# Altium schematic sheet Antenna and LoRa.SchDoc
size A3; SheetNumber: 4; SheetTotal: 5
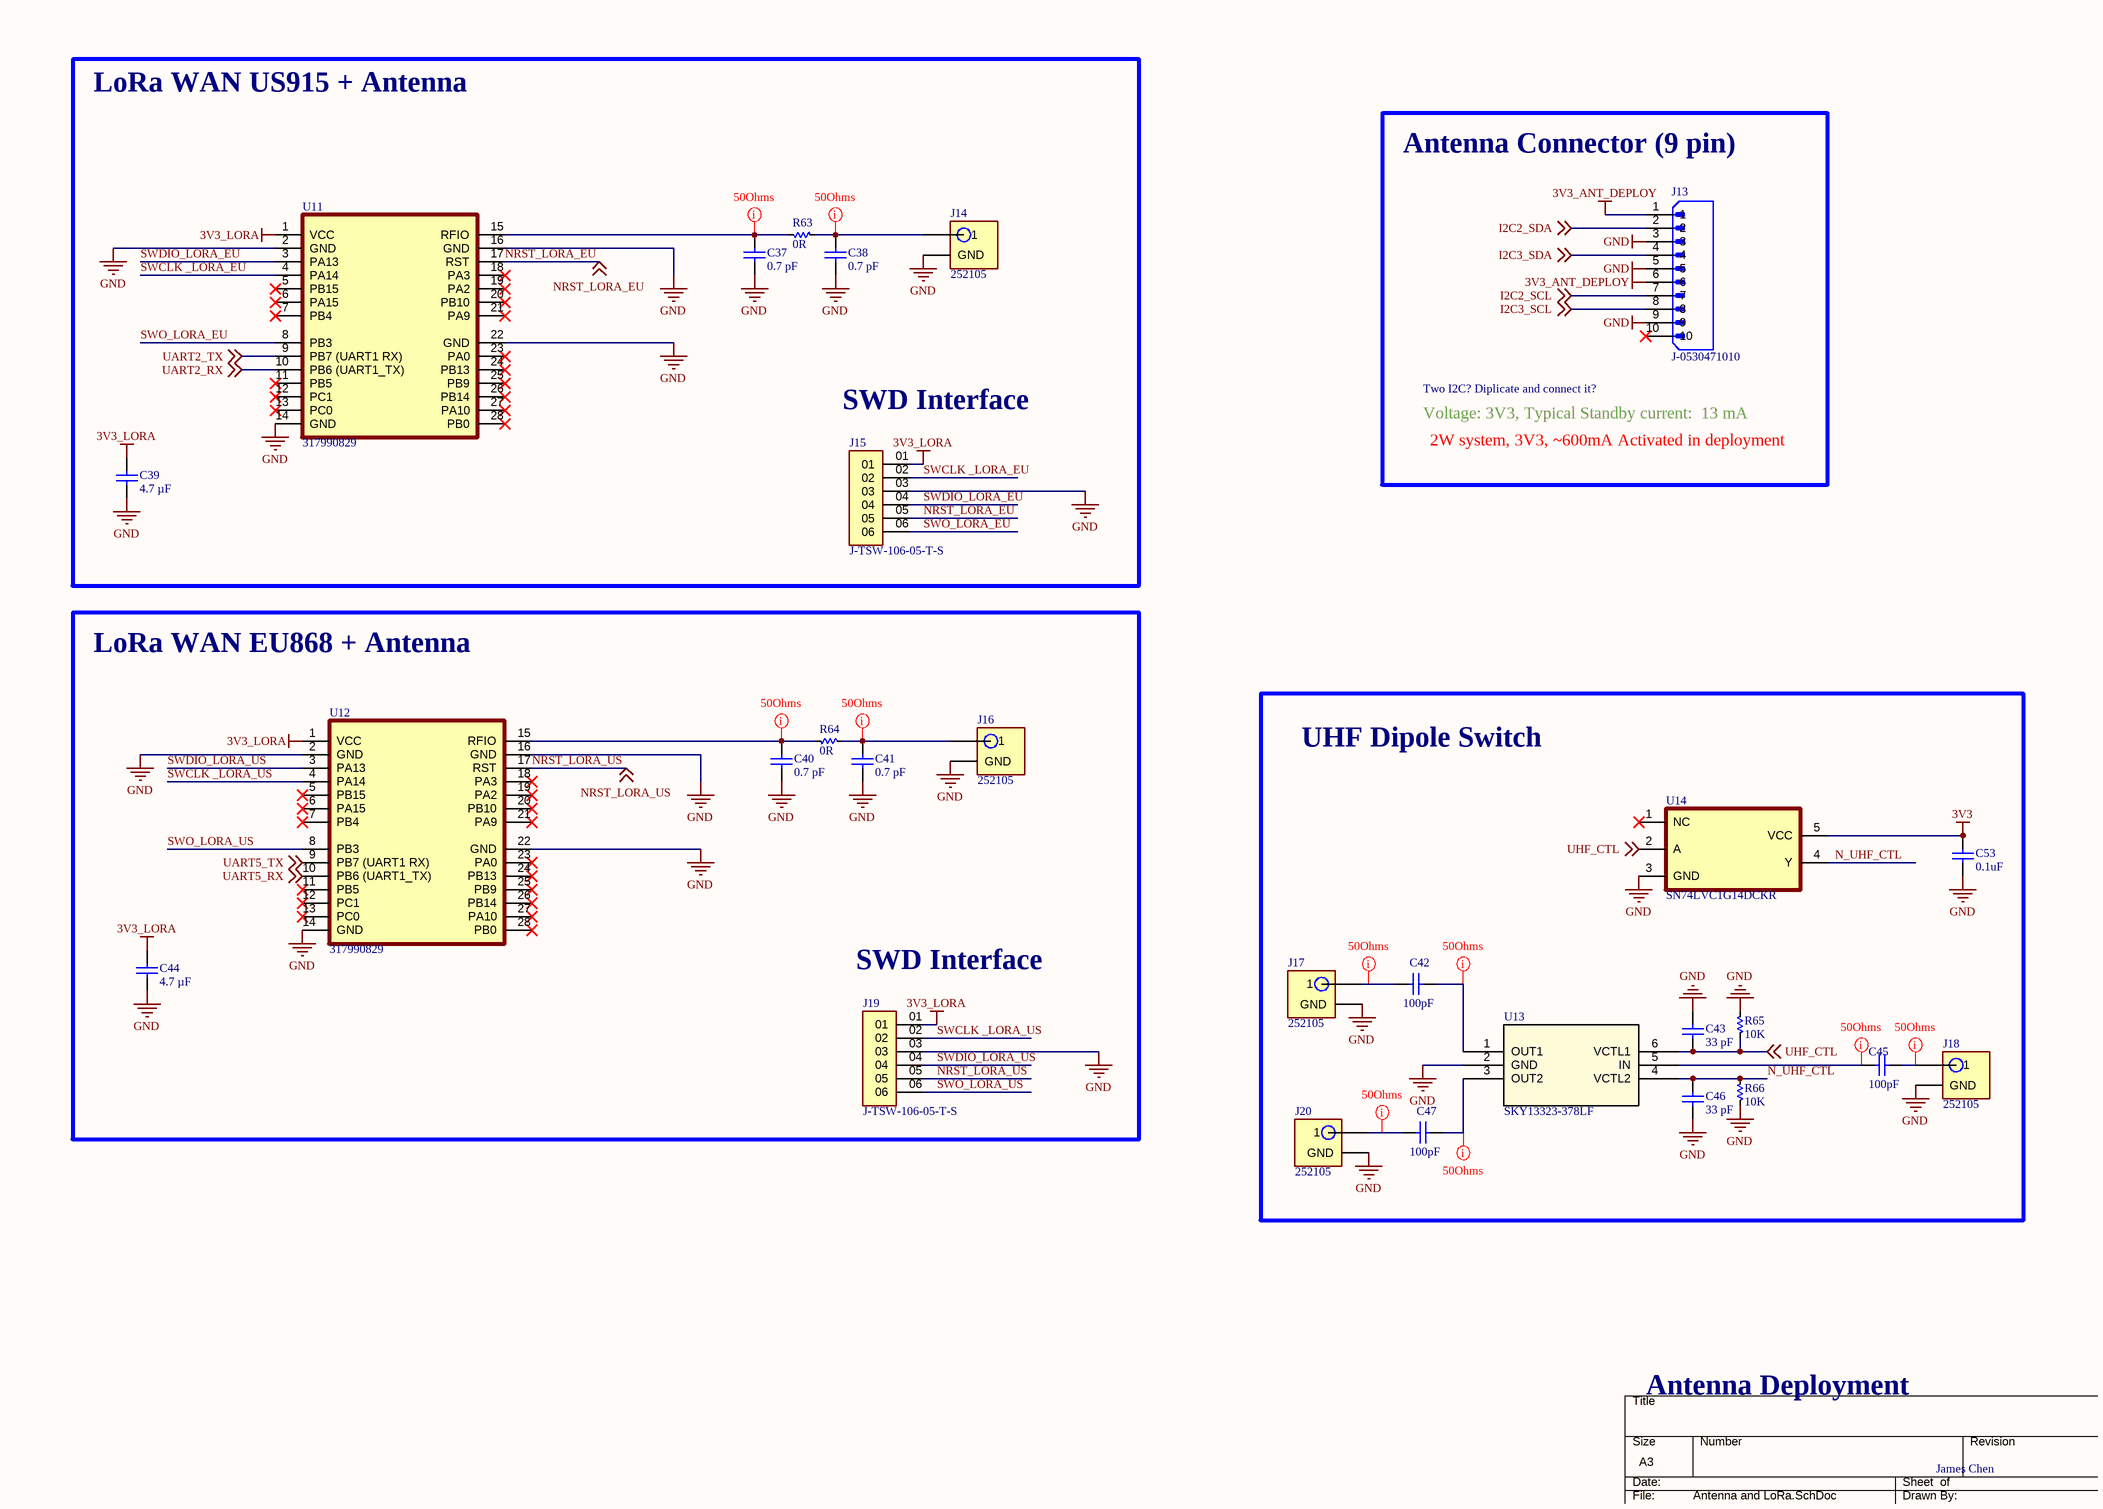
[diagram p0: Antenna and LoRa.SchDoc]

## Parts
C37  0.7 pF  [0603]
C38  0.7 pF  [0603]
C39  4.7 µF  [0603]
C40  0.7 pF  [0603]
C41  0.7 pF  [0603]
C42  100pF  [0603]
C43  33 pF  [0603]
C44  4.7 µF  [0603]
C45  100pF  [0603]
C46  33 pF  [0603]
C47  100pF  [0603]
C53  0.1uF  [0603]
J13  J-0530471010  [J-0530471010]
J14  252105  [J-252105]
J15  J-TSW-106-05-T-S  [J-TSW-106-05-T-S]
J16  252105  [J-252105]
J17  252105  [J-252105]
J18  252105  [J-252105]
J19  J-TSW-106-05-T-S  [J-TSW-106-05-T-S]
J20  252105  [J-252105]
R63  0R  [0603]
R64  0R  [0603]
R65  10K  [0603]
R66  10K  [0603]
U11  317990829  [U-LORA-E5]
U12  317990829  [U-LORA-E5]
U13  SKY13323-378LF  [U-SKY13323-378LF]
U14  SN74LVC1G14DCKR  [U-SN74LVC1G14DCKR]

## Blocks framed on the sheet
Antenna Connector (9 pin): J13
UHF Dipole Switch: C42 C43 C45-C47 C53 J17 J18 J20 R65 R66 U13 U14

## Nets
3V3: C53.2 U14.5(VCC)
3V3_ANT_DEPLOY: J13.1 J13.6
3V3_LORA: C39.2 C44.2 J15.01 J19.01 U11.1(VCC) U12.1(VCC)
GND: C37.1 C38.1 C39.1 C40.1 C41.1 C43.2 C44.1 C46.1 C53.1 J13.3 J13.5 J13.9 J14.0(GND) J15.03 J16.0(GND) J17.0(GND) J18.0(GND) J19.03 J20.0(GND) R65.2 R66.1 U11.2(GND) U11.14(GND) U11.16(GND) U11.22(GND) U12.2(GND) U12.14(GND) U12.16(GND) U12.22(GND) U13.2(GND) U14.3(GND)
I2C2_SCL: J13.7 ; off-sheet I2C2_SCL
I2C2_SDA: J13.2 ; off-sheet I2C2_SDA
I2C3_SCL: J13.8 ; off-sheet I2C3_SCL
I2C3_SDA: J13.4 ; off-sheet I2C3_SDA
N_UHF_CTL: C46.2 R66.2 U13.4(VCTL2) U14.4(Y)
NRST_LORA_EU: J15.05 U11.17(RST) ; off-sheet NRST_LORA_EU
NRST_LORA_US: J19.05 U12.17(RST) ; off-sheet NRST_LORA_US
SWCLK _LORA_EU: J15.02 U11.4(PA14)
SWCLK _LORA_US: J19.02 U12.4(PA14)
SWDIO_LORA_EU: J15.04 U11.3(PA13)
SWDIO_LORA_US: J19.04 U12.3(PA13)
SWO_LORA_EU: J15.06 U11.8(PB3)
SWO_LORA_US: J19.06 U12.8(PB3)
UART2_RX: U11.10(PB6_(UART1_TX)) ; off-sheet UART2_RX
UART2_TX: U11.9(PB7_(UART1_RX)) ; off-sheet UART2_TX
UART5_RX: U12.10(PB6_(UART1_TX)) ; off-sheet UART5_RX
UART5_TX: U12.9(PB7_(UART1_RX)) ; off-sheet UART5_TX
UHF_CTL: C43.1 R65.1 U13.6(VCTL1) U14.2(A) ; off-sheet UHF_CTL
NetC37_2: C37.2 R63.1 U11.15(RFIO)
NetC38_2: C38.2 J14.1 R63.2
NetC40_2: C40.2 R64.1 U12.15(RFIO)
NetC41_2: C41.2 J16.1 R64.2
NetC42_1: C42.1 J17.1
NetC42_2: C42.2 U13.1(OUT1)
NetC45_1: C45.1 U13.5(IN)
NetC45_2: C45.2 J18.1
NetC47_1: C47.1 J20.1
NetC47_2: C47.2 U13.3(OUT2)

Not connected (* = marked no-connect by the designer): J13 10*; U11 5(PB15)* 6(PA15)* 7(PB4)* 11(PB5)* 12(PC1)* 13(PC0)* 18(PA3)* 19(PA2)* 20(PB10)* 21(PA9)* 23(PA0)* 24(PB13)* 25(PB9)* 26(PB14)* 27(PA10)* 28(PB0)*; U12 5(PB15)* 6(PA15)* 7(PB4)* 11(PB5)* 12(PC1)* 13(PC0)* 18(PA3)* 19(PA2)* 20(PB10)* 21(PA9)* 23(PA0)* 24(PB13)* 25(PB9)* 26(PB14)* 27(PA10)* 28(PB0)*; U14 1(NC)*

## Layout directives
net class 50Ohms: NetC37_2, NetC38_2, NetC40_2, NetC41_2, NetC42_1, NetC42_2, NetC45_1, NetC45_2, NetC47_1, NetC47_2

## Notes on the sheet
- LoRa WAN US915 + Antenna
- (near J15) SWD Interface
- Voltage: 3V3, Typical Standby current:  13 mA
- Two I2C? Diplicate and connect it?
- 2W system, 3V3, ~600mA Activated in deployment
- LoRa WAN EU868 + Antenna
- (near J19) SWD Interface
- Antenna Deployment
- James Chen
- THIS DOCUMENT AND THE DATA DISCLOSED HEREIN OR
- HEREWITH IS THE PROPERTY OF ALTIUM LIMITED AND MAY
- DWG NO:
- REVISION
- REV:
- DESCRIPTION
- DATE
- APPROVED
- BE FREELY DISTRIBUTED IN WHOLE. NO RIGHTS ARE
- RESERVED OR EXPRESS OR IMPLIED WARANTEE GIVEN.
- ENG:
- APPROVALS
- PROJECT
- DSN:
- CHK:
- REFERENCE DOCUMENTS
- PROJECT REVISION:
- TITLE
- DOCUMENT REVISION:
- DESIGN ITEM:
- BOM:
- FAB DWG:
- PCB DWG:
- ASSY DWG:
- SCALE:
- A3
- SIZE
- CAGE CODE
- FILE NAME
- DWG NO.
- SHEET
- OF
- REV

## Library data of the parts
C37 C38 C40 C41 = CC-710-K-50V-X7R-0603: CAP CER 0.7PF 50V NP0 0603; Manufacturer: KEMET; Manufacturer Part #: CBR06C708B5GAC; ComponentLink1description: Datasheet; ComponentLink1URL: https://ds.yuden.co.jp/TYCOMPAS/ut/detail?pn=TMK105BJ104KV-F%20%20&u=M; ComponentLink2description: Manufacturer Website; Distributor: Digikey; Distributor Part #: 399-CBR06C708B5GACCT-ND; ComponentLink2URL: https://www.yuden.co.jp/or/; Value: 0.7 pF
C39 C44 = CC-105-K-25V-X7R-0603: CAP CER 4.7UF 16V X7R 0603; Manufacturer: Murata Electronics; Manufacturer Part #: GRM188Z71C475KE21J; Distributor: Digikey; Distributor Part #: 490-GRM188Z71C475KE21JCT-ND; Value: 4.7 µF
C42 C45 C47 = CC-104-K-25V-X5R-0402: CAP CER 100PF 50V X7R 0603; Manufacturer: YAGEO; Manufacturer Part #: CC0603KRX7R9BB101; ComponentLink1description: Datasheet; ComponentLink1URL: https://ds.yuden.co.jp/TYCOMPAS/ut/detail?pn=TMK105BJ104KV-F%20%20&u=M; ComponentLink2description: Manufacturer Website; Distributor: Digikey; Distributor Part #: 311-3601-1-ND; Part Description: CAP CER 100PF 50V X7R 0603; ComponentLink2URL: https://www.yuden.co.jp/or/; Value: 100pF
C43 C46 = CC-339-K-50V-X7R-0603: CAP CER 33PF 50V X7R 0603; Manufacturer: KEMET; Manufacturer Part #: C0603C330K5RAC7867; ComponentLink1description: Datasheet; ComponentLink1URL: https://ds.yuden.co.jp/TYCOMPAS/ut/detail?pn=TMK105BJ104KV-F%20%20&u=M; ComponentLink2description: Manufacturer Website; Distributor: Digikey; Distributor Part #: 399-C0603C330K5RAC7867CT-ND; Part Description: CAP CER 33PF 50V X7R 0603; ComponentLink2URL: https://www.yuden.co.jp/or/; Value: 33 pF
C53 = CC-104-K-25V-X7R-0603: 0.1 µF ±10% 25V Ceramic Capacitor X7R 0603 (1608 Metric); Manufacturer: Samsung Electro-Mechanics; Manufacturer Part #: CL10B104KA8NNNC; ComponentLink1description: Datasheet; ComponentLink1URL: https://ds.yuden.co.jp/TYCOMPAS/ut/detail?pn=TMK105BJ104KV-F%20%20&u=M; ComponentLink2description: Manufacturer Website; Distributor: Digikey; Distributor Part #: 1276-1006-1-ND; Part Description: 0.1 µF ±10% 25V Ceramic Capacitor X7R 0603 (1608 Metric); ComponentLink2URL: https://www.yuden.co.jp/or/; Value: 0.1uF
J13 = J-0530471010: CONN HEADER VERT 10POS 1.25MM; Manufacturer: Molex; Manufacturer Part #: 0530471010; Distributor: Digikey; Distributor Part #: WM1739-ND
J14 J16-J18 J20 = J-252105: CONN MCX RCPT STR 50 OHM PCB; Manufacturer: Amphenol RF; Manufacturer Part #: 252105; Distributor Part #: ACX1262-ND; Distributor: Digikey
J15 J19 = J-TSW-106-05-T-S: CONN HEADER VERT 6POS 2.54MM; Distrbutor part #: SAM12323-ND; Manufacturer: Samtec; Distrbutor: None; Manufacturer Part #: TSW-106-05-T-S; Price: None
R63 R64 = RT-0R00-F-1/10W-0603: 0 Ohms Jumper 0.1W, 1/10W Chip Resistor 0603 (1608 Metric) Automotive AEC-Q200 Thick Film; Manufacturer: Stackpole Electronics Inc; Manufacturer Part #: RMCF0603ZT0R00; ComponentLink1description: Datasheet; ComponentLink1URL: https://industrial.panasonic.com/ww/products/resistors/chip-resistors/general-purpose-chip-resistors/models/ERJ2GE0R00X; ComponentLink2description: Manufacturer Website; Distributor: Digikey; Distributor Part #: RMCF0603ZT0R00CT-ND; Part Description: 0 Ohms Jumper 0.1W, 1/10W Chip Resistor 0603 (1608 Metric) Automotive AEC-Q200 Thick Film; ComponentLink2URL: https://industrial.panasonic.com/ww/products/resistors/chip-resistors/general-purpose-chip-resistors/models/ERJ2GE0R00X; Value: 0R
R65 R66 = RT-10K0-F-1/16W-0603: 10 kOhms ±0.1% 0.063W, 1/16W Chip Resistor 0603 (1608 Metric) - Thin Film; Manufacturer: TE Connectivity Passive Product; Manufacturer Part #: CPF0603B10KE; ComponentLink1description: Datasheet; ComponentLink1URL: https://www.vishay.com/docs/20035/dcrcwe3.pdf; ComponentLink2description: Manufacturer Website; Distributor: Digikey; Distributor Part #: A119886CT-ND; Part Description: 10 kOhms ±0.1% 0.063W, 1/16W Chip Resistor 0603 (1608 Metric) - Thin Film; ComponentLink2URL: https://www.vishay.com/; Value: 10K
U11 U12 = U-LORA-E5: LORA-E5 WIRELESS MODULE (TAPE RE; Manufacturer: Seeed Technology Co., Ltd; Manufacturer Part #: 317990829; Distributor: Digikey; Distributor Part #: 1597-317990829CT-ND
U13 = U-SKY13323-378LF: IC RF SWITCH SPDT 3GHZ 6MLPD; Manufacturer: Skyworks Solutions Inc.; Distrbutor Part #: 683-1334-1-ND; Manufacturer Part #: SKY13323-378LF; Distributor: Digikey
U14 = U-SN74LVC1G14DCKR: IC INVERT SCHMITT 1CH 1IN SC70; Manufactuer: Texas Instruments; Distributor: Digikey; Manufacturer Part Number: SN74LVC1G14DCKR; Distributor Part Number: 296-11608-1-ND